# Altium project CECILIA_00.PrjPcb
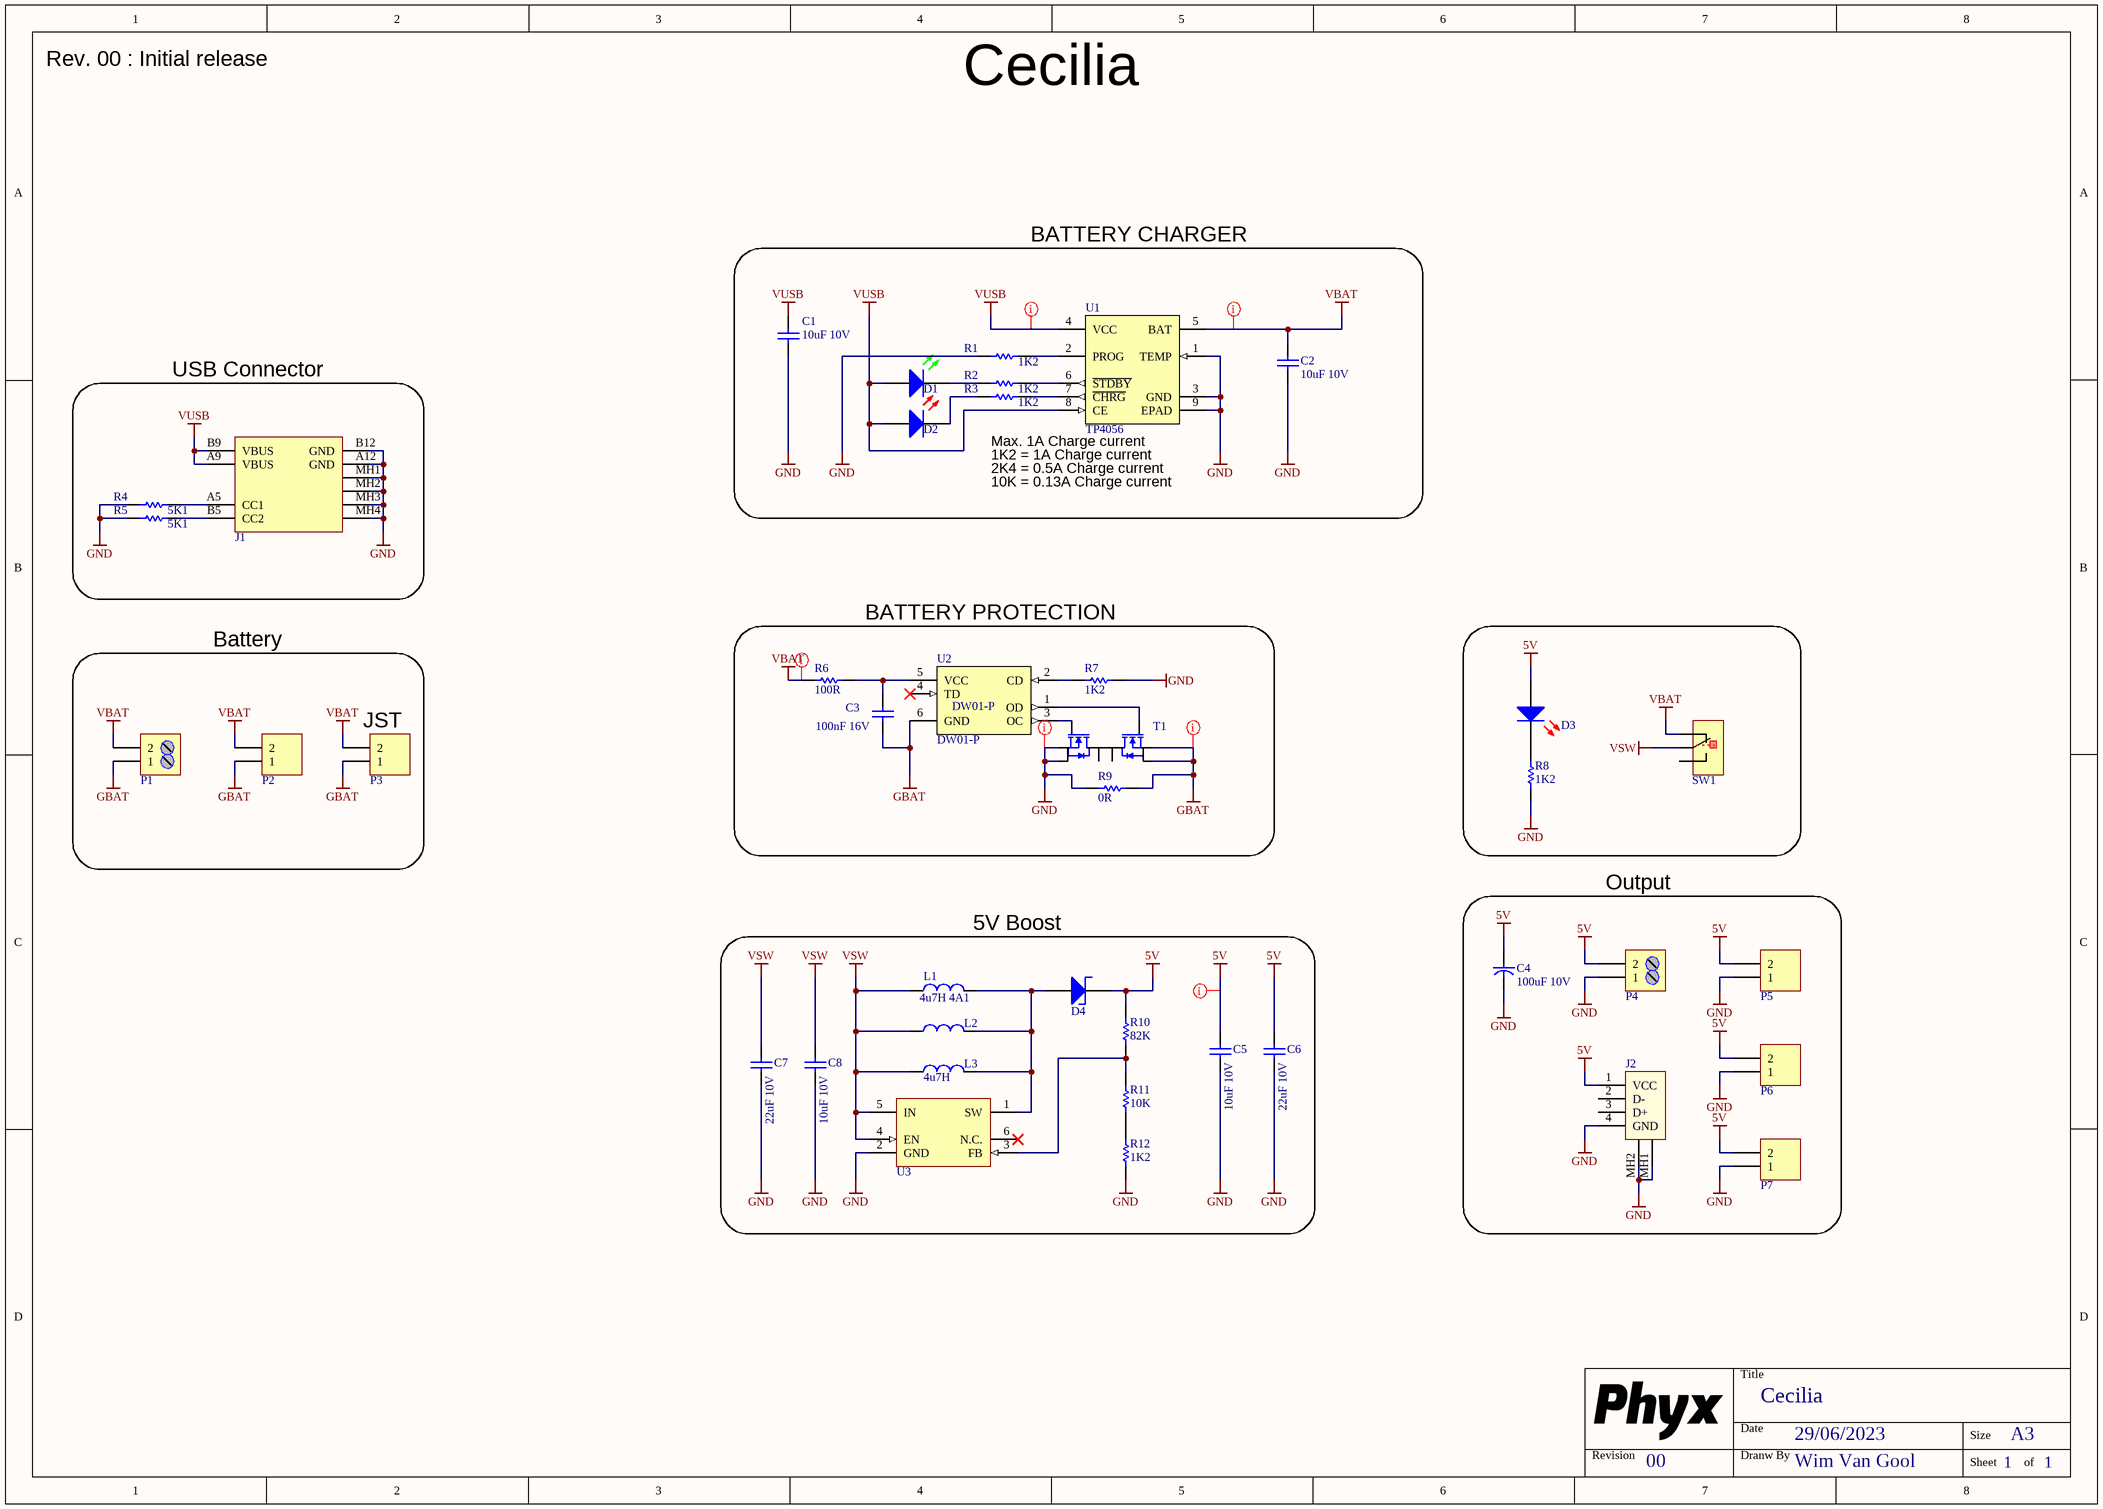
[diagram p0: CECILIA_00.SchDoc]
PCB_ENGINEER: WimVG; PCB_REV: 00; PCB_TITLE: Cecilia
1 sheet, 41 parts. Net scope: global (net labels, ports and power ports of the same name join across sheets).
Board file: CECILIA_00.PcbDoc

## Sheet CECILIA_00.SchDoc: Cecilia
size A3; Date: 29/06/2023; DrawnBy: Wim Van Gool; DocumentNumber: 1; Revision: 00; SheetNumber: 1; SheetTotal: 1

### Parts
C1  value 10uF 10V  [C0805_N]  (hidden comment: CAP_CERAMIC)
C2  value 10uF 10V  [C0805_N]  (hidden comment: CAP_CERAMIC)
C3  value 100nF 16V  [C0603_N]
C4  value 100uF 10V  [C_5x11_2mm]  (hidden comment: CAP_POL)
C5  value 10uF 10V  [C0805_N]  (hidden comment: CAP_CERAMIC)
C6  value 22uF 10V  [C1210_N]  (hidden comment: CAP_CERAMIC)
C7  value 22uF 10V  [C1210_N]  (hidden comment: CAP_CERAMIC)
C8  value 10uF 10V  [C0805_N]  (hidden comment: CAP_CERAMIC)
D1  Default 0805 Green LED  [LED_0805_GR]  (value not drawn)
D2  Default 0805 Red LED  [LED_0805_RD]  (value not drawn)
D3  Default 0805 Red LED  [LED_0805_RD]  (value not drawn)
D4  TSS83L45 MWG Schottky ULTRAFAST, 3A, 45V  [TS_SOD128]  (value not drawn)
J1  USB PWR C Reversible Receptacle Horizontal  [XKB_U262-061N-4BVC10]  (value not drawn)
J2  USB type A Short horizontal connector  [WE_614104150121]  (value not drawn)
L1  value 4u7H 4A1  [TAI_NRS8040]  (hidden comment: NRS8040T4R7NJGJ)
L2  VLC6045T-3R3N  [IND_6045]  (value not drawn)
L3  value 4u7H  [SNL_SWPA4020]  (hidden comment: SWPA4020S4R7MT)
P1  2 Way Screw HDR 5,08mm  [TERM_BLK-0508-2-90]  (value not drawn)
P2  Header 2  [HDR1X2]  (value not drawn)
P3  Header RA 1.5mm Shrouded S2B-ZR-SM4A-TF  [JST_ZH_S2B-ZR-SM4A-TF]  (value not drawn)
P4  2 Way Screw HDR 5,08mm  [TERM_BLK-0508-2-90]  (value not drawn)
P5  Header 2  [HDR1X2]  (value not drawn)
P6  Header 2  [HDR1X2]  (value not drawn)
P7  Header 2  [HDR1X2]  (value not drawn)
R1  value 1K2  [R0603_N]  (hidden comment: RESISTOR)
R2  value 1K2  [R0603_N]  (hidden comment: RESISTOR)
R3  value 1K2  [R0603_N]  (hidden comment: RESISTOR)
R4  value 5K1  [R0603_N]  (hidden comment: RESISTOR)
R5  value 5K1  [R0603_N]  (hidden comment: RESISTOR)
R6  value 100R  [R0603_N]  (hidden comment: RESISTOR)
R7  value 1K2  [R0603_N]  (hidden comment: RESISTOR)
R8  value 1K2  [R0603_N]  (hidden comment: RESISTOR)
R9  value 0R  [R1206]  (hidden comment: RESISTOR)
R10  value 82K  [R0603_N]  (hidden comment: RESISTOR)
R11  value 10K  [R0603_N]  (hidden comment: RESISTOR)
R12  value 1K2  [R0603_N]  (hidden comment: RESISTOR)
SW1  mini Switch 1 pole double throw right angle  [SK-12D07]  (value not drawn)
T1  Dual N-Ch MOSFET Common Drain  [TSSOP_8_65P]  (value not drawn)
U1  value TP4056  [SOIC_N_8_TH]  (hidden comment: Single Cell LiIon charger max 1A)
U2  value DW01-P  [SOT23-6]  (hidden comment: DW01-P single cell lithium protection)
U3  High Efficiency 1.2MHz 2A Step Up Converter  SX1308  [SOT23-6]  (value not drawn)

### Blocks framed on the sheet
BATTERY CHARGER: C1 C2 D1 D2 R1-R3 U1
USB Connector: J1 R4 R5
BATTERY PROTECTION: C3 R6 R7 R9 T1 U2
Output: C4 J2 P4-P7
5V Boost: C5-C8 D4 L1-L3 R10-R12 U3

### Nets
5V: C4.1 C5.1 C6.1 D3.1(A) D4.1(C) J2.1(VCC) P4.2 P5.2 P6.2 P7.2 R10.1
GBAT: C3.2 P1.1 P2.1 P3.1 R9.1 T1.2(S1) T1.3(S1) U2.6(GND)
GND: C1.2 C2.2 C4.2 C5.2 C6.2 C7.2 C8.2 J1.A12(GND) J1.B12(GND) J1.MH1(Tab) J1.MH2(Tab) J1.MH3(Tab) J1.MH4(Tab) J2.4(GND) J2.MH1(Tab) J2.MH2(Tab) P4.1 P5.1 P6.1 P7.1 R1.2 R4.2 R5.2 R7.2 R8.2 R9.2 R12.2 T1.6(S2) T1.7(S2) U1.1(TEMP) U1.3(GND) U1.9(EPAD) U3.2(GND)
VBAT: C2.1 P1.2 P2.2 P3.2 R6.1 SW1.1 U1.5(BAT)
VSW: C7.1 C8.1 L1.1 L2.1 L3.1 SW1.2 U3.4(EN) U3.5(IN)
VUSB: C1.1 D1.1(A) D2.1(A) J1.A9(VBUS) J1.B9(VBUS) U1.4(VCC) U1.8(CE)
NetC3_1: C3.1 R6.2 U2.5(VCC)
NetD1_2: D1.2(K) R2.1
NetD2_2: D2.2(K) R3.1
NetD3_2: D3.2(K) R8.1
NetD4_2: D4.2(A) L1.2 L2.2 L3.2 U3.1(SW)
NetJ1_A5: J1.A5(CC1) R4.1
NetJ1_B5: J1.B5(CC2) R5.1
NetR1_1: R1.1 U1.2(PROG)
NetR2_2: R2.2 U1.6(~{STDBY})
NetR3_2: R3.2 U1.7(~{CHRG})
NetR7_1: R7.1 U2.2(CD)
NetR10_2: R10.2 R11.1 U3.3(FB)
NetR11_2: R11.2 R12.1
NetT1_4: T1.4(G1) U2.1(OD)
NetT1_5: T1.5(G2) U2.3(OC)

Not connected (* = marked no-connect by the designer): J2 2(D-) 3(D+); SW1 3; T1 1(D1) 8(D2); U2 4(TD)*; U3 6(N.C.)*

### Layout directives
net class POWER: 5V, GBAT, GND, VBAT, VUSB

### Notes on the sheet
- Rev. 00 : Initial release
- Max. 1A Charge current
- 1K2 = 1A Charge current
- 2K4 = 0.5A Charge current
- 10K = 0.13A Charge current
- Battery
- (near P3) JST
- Title
- Revision
- Date
- Dranw By
- Size
- A3
- Sheet
- of

### Library data of the parts
C1 C2 C5 C8 = CAP # 10uF 10V 0805: Capacitor Ceramic; Supplier 1: Farnell; Supplier Part Number 1: 2320859
C3 = CAP # 100nF 16V 0603: Capacitor Ceramic
C4 = CAP 100uF 10V 5x11mm: Capacitor electrolyt; Supplier 1: Farnell; Supplier Part Number 1: 1902882
C6 C7 = CAP # 22uF 10V 1210 X5R: Capacitor Ceramic
D1 = LED # Green 0805: =Description; Supplier 1: Farnell; Supplier Part Number 1: 2099239
D2 D3 = LED # Red 0805: =Description; Supplier 1: Farnell; Supplier Part Number 1: 2099236
D4 = Schottky # TSS83L45MWG 3A 45V: =Description; Value: TSS83L45 MWG; Supplier 1: Digi-key; Supplier Part Number 1: TSS83L45MWGCT-ND
J1 = USB # C PWR RCPT U262-061N-4BVC10: Value: U262-061N-4BVC10; Supplier 1: LCSC; Supplier Part Number 1: C2927029; Supplier 2: LCSC; Supplier Part Number 2: C2894893; Supplier 3: LCSC; Supplier Part Number 3: C692420
J2 = USB A 614104150121 Short: Value: 614104150121; Supplier 1: Farnell; Supplier Part Number 1: 2470819; Supplier 2: Wurth; Supplier Part Number 2: 614104150121; Supplier 3: Mouser; Supplier Part Number 3: 710-614104150121
L1 = IND # 4u7H 4A1 NRS8040T4R7NJGJ: Supplier 1: Digi-key; Supplier Part Number 1: 587-2978-1-ND
L2 = IND # 3u3H 6x6mm: Value: 3u3H; Supplier 1: Digi-key; Supplier Part Number 1: 445-6536-1-ND
L3 = IND # 4u7H SWPA4020: Supplier 1: China; Supplier Part Number 1: SWPA4020S4R7MT
P1 P4 = Terminal Block 5.08mm 2way: Value: PM5.08/2/90; Supplier 1: Farnell; Supplier Part Number 1: 1131853; Supplier 2: LCSC; Supplier Part Number 2: C8465
P2 P5-P7 = Pin Header 2.54mm 2way: Supplier 1: LCSC; Supplier Part Number 1: C492401; Supplier 2: LCSC; Supplier Part Number 2: C541856
P3 = HDR # RA SHR 1.5mm 2way - S2B-ZR-SM4A-TF: Value: S2B-ZR-SM4A-TF; Supplier 1: LCSC; Supplier Part Number 1: C265329; Supplier 2: Farnell; Supplier Part Number 2: 1830920; Supplier 3: Digi-Key; Supplier Part Number 3: 455-1693-1-ND
R1-R3 R7 R8 R12 = RES # 1K2 0603
R4 R5 = RES # 5K1 0603: Supplier 1: Farnell; Supplier Part Number 1: 2845922; Supplier 2: LCSC; Supplier Part Number 2: C112314; Supplier 3: Generic; Supplier Part Number 3: 5K1 1% 0603
R6 = RES # 100R 0603
R9 = RES # 0R 1206
R10 = RES # 82K 0603
R11 = RES # 10K 0603: Supplier 1: Farnell; Supplier Part Number 1: 2502397
SW1 = SW 1P2T micro RA SK-12D07: Value: SK-12D07; Supplier 1: AliExpress; Supplier Part Number 1: SK-12D07
T1 = FS8205A Dual N-Ch common Drain for DW01-P: =Description; Value: FS8205A; Supplier 1: AliExpress; Supplier Part Number 1: FS8205A
U1 = CHG # TP4056 LiIon 1A: =Description; Supplier 1: Aliexpress; Supplier Part Number 1: TP4056
U2 = PWR # DW01-P Lithium protection: =Description; Supplier 1: Aliexpress; Supplier Part Number 1: DW01-P
U3 = PWR # Boost SX1308: =Description; Value: SX1308

## Assembly variants
No Protection: not fitted C3 C4 L2 L3 P2 P3 P4 P5 P6 P7 R6 R7 T1 U2
Default: not fitted C4 J2 L2 L3 P2 P3 P4 P5 P6 P7 R9
SMD Only No Protection: not fitted C3 C4 J2 L2 L3 P1 P2 P3 P4 P5 P6 P7 R6 R7 SW1 T1 U2